# EAGLE design Fubarino_SDZ_v10 (EAGLE 6.5.0)
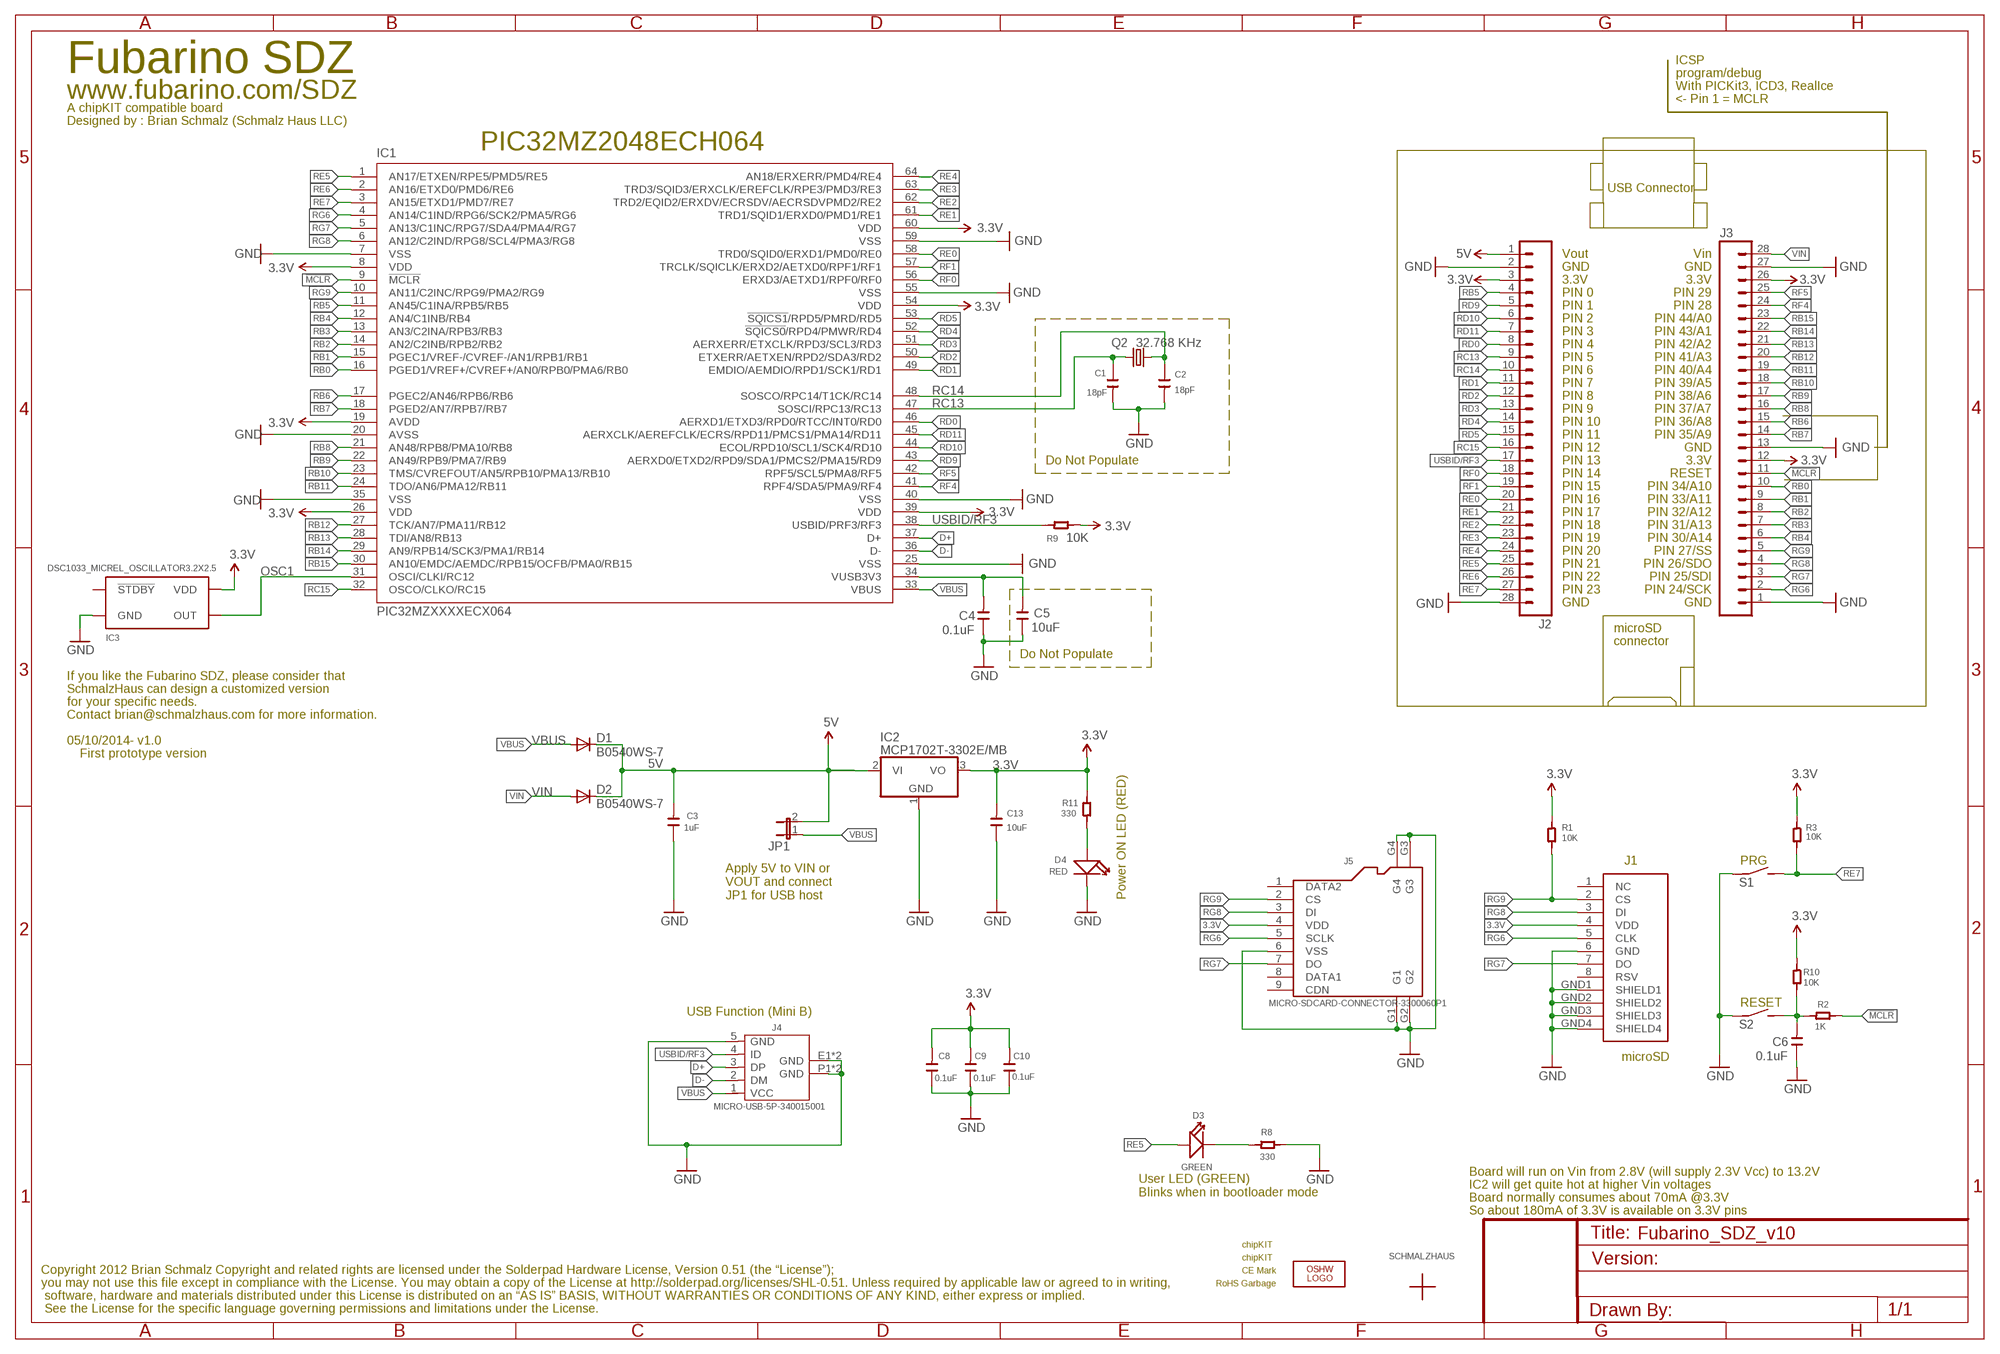
[diagram p0: schematic, sheet 1]

## Parts
C1  18pF  C-0603  [C0603]
C2  18pF  C-0603  [C0603]
C3  1uF  C-0603  [C0603]
C4  0.1uF  C-0603  [C0603]
C5  10uF  C-0805  [C0805]
C6  0.1uF  C-0603  [C0603]
C8  0.1uF  C-0603  [C0603]
C9  0.1uF  C-0603  [C0603]
C10  0.1uF  C-0603  [C0603]
C13  10uF  C-0805  [C0805]
D1  B0540WS-7  DIODESOD  [SOD-323]
D2  B0540WS-7  DIODESOD  [SOD-323]
D3  GREEN  LED  [LED0603]
D4  RED  LED  [LED0603]
IC1  PIC32MZXXXXECX064  [TQFP64-10X10]
IC2  MCP1702T-3302E/MB  MCP170333MB  [SOT89]
IC3  DSC1033_MICREL_OSCILLATOR3.2X2.5  [3.2X2.5_SILABS_OSC_DSC1033]
J1  MICRO_SD_CARD_SOCKET  [SD-MMC_SOCKET-PP]
J2  M28USEPIN1  [1X28]
J3  M28NOPIN1  [1X28_NO_PIN_1]
J4  MICRO-USB-5P-340015001  [B-SMD-5P]
J5  MICRO-SDCARD-CONNECTOR-3300060P1  [9P-SMD-W-RING]
JP1  JUMPER-2SMD-NO  [SJ_2S-NO]
LOGO1  OSHW_LOGO_8MILX0070-NT  [OSHW_8X70_NOTEXT]
Q2  32.768 KHz  CRYSTALTC26H  [TC26H]
R1  10K  R-0603  [R0603]
R2  1K  R-0603  [R0603]
R3  10K  R-0603  [R0603]
R8  330  R-0603  [R0603]
R9  10K  R-0603  [R0603]
R10  10K  R-0603  [R0603]
R11  330  R-0603  [R0603]
S1  SWITCH  [SWITCH_KMR_SMT_TACT]
S2  SWITCH  [SWITCH_KMR_SMT_TACT]
U$1  SCHMALZHAUSSCHMALZHAUS_SMALL  [SCHMALZHAUS_SMALL]
U$2  CE_MARK5MM  [CE_5MM]
U$3  ROHS_GARBAGE  [ROHS_GARBAGE_5MM]
U$4  CHIPKIT2MM  [CHIPKIT_2MM]
U$5  CHIPKIT2MM  [CHIPKIT_2MM]

## Nets
3.3V: C8.1 C9.1 C10.1 C13.1 IC1.8(VDD) IC1.19(AVDD) IC1.26(VDD) IC1.39(VDD) IC1.54(VDD) IC1.60(VDD) IC2.3(VO) IC3.P$4(VDD) J1.4(VDD) J2.3 J3.12 J3.26 J5.4(VDD) R1.1 R3.1 R9.2 R10.1 R11.2
5V: C3.1 D1.1(C) D2.1(C) IC2.2(VI) IC2.2@1(VI1) J2.1 JP1.2
!MCLR!: IC1.9(!MCLR!) J3.11 R2.2
$MCLR: C6.1 R2.1 R10.2 S2.P$3 S2.P$4
D+: IC1.37(D+) J4.3(DP)
D-: IC1.36(D-) J4.2(DM)
GND: C1.1 C2.1 C3.2 C4.2 C5.2 C6.2 C8.2 C9.2 C10.2 C13.2 D4.- IC1.7(VSS) IC1.20(AVSS) IC1.25(VSS) IC1.35(VSS) IC1.40(VSS) IC1.55(VSS) IC1.59(VSS) IC2.1(GND) IC3.P$2(GND) J1.6(GND) J1.GND1(SHIELD1) J1.GND2(SHIELD2) J1.GND3(SHIELD3) J1.GND4(SHIELD4) J2.2 J2.28 J3.1 J3.13 J3.27 J4.5(GND) J4.E1(GND) J4.E2(GND) J4.P1(GND) J4.P2(GND) J5.6(VSS) J5.G1 J5.G2 J5.G3 J5.G4 R8.2 S1.P$1 S1.P$2 S2.P$1 S2.P$2
N$6: D4.+ R11.1
N$20: D3.- R8.1
N$110: C4.1 C5.1 IC1.34(VUSB3V3)
OSC1: IC1.31(OSCI/CLKI/RC12) IC3.P$3(OUT)
RB0: IC1.16(PGED1/VREF+/CVREF+/AN0/RPB0/PMA6/RB0) J3.10
RB1: IC1.15(PGEC1/VREF-/CVREF-/AN1/RPB1/RB1) J3.9
RB2: IC1.14(AN2/C2INB/RPB2/RB2) J3.8
RB3: IC1.13(AN3/C2INA/RPB3/RB3) J3.7
RB4: IC1.12(AN4/C1INB/RB4) J3.6
RB5: IC1.11(AN45/C1INA/RPB5/RB5) J2.4
RB6: IC1.17(PGEC2/AN46/RPB6/RB6) J3.15
RB7: IC1.18(PGED2/AN7/RPB7/RB7) J3.14
RB8: IC1.21(AN48/RPB8/PMA10/RB8) J3.16
RB9: IC1.22(AN49/RPB9/PMA7/RB9) J3.17
RB10: IC1.23(TMS/CVREFOUT/AN5/RPB10/PMA13/RB10) J3.18
RB11: IC1.24(TDO/AN6/PMA12/RB11) J3.19
RB12: IC1.27(TCK/AN7/PMA11/RB12) J3.20
RB13: IC1.28(TDI/AN8/RB13) J3.21
RB14: IC1.29(AN9/RPB14/SCK3/PMA1/RB14) J3.22
RB15: IC1.30(AN10/EMDC/AEMDC/RPB15/OCFB/PMA0/RB15) J3.23
RC13: C1.2 IC1.47(SOSCI/RPC13/RC13) J2.9 Q2.1
RC14: C2.2 IC1.48(SOSCO/RPC14/T1CK/RC14) J2.10 Q2.2
RC15: IC1.32(OSCO/CLKO/RC15) J2.16
RD0: IC1.46(AERXD1/ETXD3/RPD0/RTCC/INT0/RD0) J2.8
RD1: IC1.49(EMDIO/AEMDIO/RPD1/SCK1/RD1) J2.11
RD2: IC1.50(ETXERR/AETXEN/RPD2/SDA3/RD2) J2.12
RD3: IC1.51(AERXERR/ETXCLK/RPD3/SCL3/RD3) J2.13
RD4: IC1.52(!SQICS0!/RPD4/PMWR/RD4) J2.14
RD5: IC1.53(!SQICS1!/RPD5/PMRD/RD5) J2.15
RD9: IC1.43(AERXD0/ETXD2/RPD9/SDA1/PMCS2/PMA15/RD9) J2.5
RD10: IC1.44(ECOL/RPD10/SCL1/SCK4/RD10) J2.6
RD11: IC1.45(AERXCLK/AEREFCLK/ECRS/RPD11/PMCS1/PMA14/RD11) J2.7
RE0: IC1.58(TRD0/SQID0/ERXD1/PMD0/RE0) J2.20
RE1: IC1.61(TRD1/SQID1/ERXD0/PMD1/RE1) J2.21
RE2: IC1.62(TRD2/EQID2/ERXDV/ECRSDV/AECRSDVPMD2/RE2) J2.22
RE3: IC1.63(TRD3/SQID3/ERXCLK/EREFCLK/RPE3/PMD3/RE3) J2.23
RE4: IC1.64(AN18/ERXERR/PMD4/RE4) J2.24
RE5: D3.+ IC1.1(AN17/ETXEN/RPE5/PMD5/RE5) J2.25
RE6: IC1.2(AN16/ETXD0/PMD6/RE6) J2.26
RE7: IC1.3(AN15/ETXD1/PMD7/RE7) J2.27 R3.2 S1.P$3 S1.P$4
RF0: IC1.56(ERXD3/AETXD1/RPF0/RF0) J2.18
RF1: IC1.57(TRCLK/SQICLK/ERXD2/AETXD0/RPF1/RF1) J2.19
RF4: IC1.41(RPF4/SDA5/PMA9/RF4) J3.24
RF5: IC1.42(RPF5/SCL5/PMA8/RF5) J3.25
RG6: IC1.4(AN14/C1IND/RPG6/SCK2/PMA5/RG6) J1.5(CLK) J3.2 J5.5(SCLK)
RG7: IC1.5(AN13/C1INC/RPG7/SDA4/PMA4/RG7) J1.7(DO) J3.3 J5.7(DO)
RG8: IC1.6(AN12/C2IND/RPG8/SCL4/PMA3/RG8) J1.3(DI) J3.4 J5.3(DI)
RG9: IC1.10(AN11/C2INC/RPG9/PMA2/RG9) J1.2(CS) J3.5 J5.2(CS) R1.2
USBID/RF3: IC1.38(USBID/PRF3/RF3) J2.17 J4.4(ID) R9.1
VBUS: D1.2(A) IC1.33(VBUS) J4.1(VCC) JP1.1
VIN: D2.2(A) J3.28
Unconnected: IC3.P$1(!STDBY!) J1.1(NC) J1.8(RSV) J5.1(DATA2) J5.8(DATA1) J5.9(CDN)

## Notes on the sheet
- ICSP
- Fubarino SDZ
- program/debug
- With PICKit3, ICD3, RealIce
- www.fubarino.com/SDZ
- <- Pin 1 = MCLR
- A chipKIT compatible board
- Designed by : Brian Schmalz (Schmalz Haus LLC)
- PIC32MZ2048ECH064
- USB Connector
- Vin
- Vout
- GND
- GND
- 3.3V
- 3.3V
- PIN 29
- PIN 0
- PIN 28
- PIN 1
- PIN 44/A0
- PIN 2
- PIN 43/A1
- PIN 3
- PIN 42/A2
- PIN 4
- PIN 41/A3
- PIN 5
- PIN 40/A4
- PIN 6
- PIN 39/A5
- PIN 7
- PIN 38/A6
- PIN 8
- PIN 37/A7
- PIN 9
- PIN 36/A8
- PIN 10
- PIN 35/A9
- PIN 11
- GND
- PIN 12
- 3.3V
- Do Not Populate | PIN 13
- RESET
- PIN 14
- PIN 34/A10
- PIN 15
- PIN 33/A11
- PIN 16
- PIN 32/A12
- PIN 17
- PIN 31/A13
- PIN 18
- PIN 30/A14
- PIN 19
- PIN 27/SS
- PIN 20
- PIN 26/SDO
- PIN 21
- PIN 25/SDI
- PIN 22
- PIN 24/SCK
- PIN 23
- GND
- GND
- microSD
- connector
- Do Not Populate
- If you like the Fubarino SDZ, please consider that
- SchmalzHaus can design a customized version
- for your specific needs.
- Contact brian@schmalzhaus.com for more information.
- 05/10/2014- v1.0
- First prototype version
- J1 | PRG
- Apply 5V to VIN or 
  VOUT and connect 
  JP1 for USB host
- Power ON LED (RED)
- RESET
- USB Function (Mini B)
- microSD
- Board will run on Vin from 2.8V (will supply 2.3V Vcc) to 13.2V
- IC2 will get quite hot at higher Vin voltages
- User LED (GREEN)
  Blinks when in bootloader mode
- Board normally consumes about 70mA @3.3V
- So about 180mA of 3.3V is available on 3.3V pins
- Copyright 2012 Brian Schmalz Copyright and related rights are licensed under the Solderpad Hardware License, Version 0.51 (the “License”);
- you may not use this file except in compliance with the License. You may obtain a copy of the License at http://solderpad.org/licenses/SHL-0.51. Unless required by applicable law or agreed to in writing,
- software, hardware and materials distributed under this License is distributed on an “AS IS” BASIS, WITHOUT WARRANTIES OR CONDITIONS OF ANY KIND, either express or implied.
- See the License for the specific language governing permissions and limitations under the License.

## Library data of the parts
C1-C6 C8-C10 C13 = OPL Eagle Library:C*
D1 D2 = SparkFun:DIODE: Diode These are standard reverse protection diodes and small signal diodes. SMA package can handle up to about 1A. SOD-323 can handle about 200mA. What the SOD-323 package when ordering, there are some mfgs out there that are 5-pin packages.
D3 D4 = OPL Eagle Library:LED*: LED
IC1 = SchmalzHaus:PIC32MZXXXXECX064: PIC32MZxxxxECx064 TQFP 10mm x 10mm http://ww1.microchip.com/downloads/en/DeviceDoc/60001191B.pdf
IC2 = linear:MCP1703*: 250 mA, 16V, Low Quiescent Current LDO Regulator Source: http://ww1.microchip.com/downloads/en/DeviceDoc/22049b.pdf
IC3 = SchmalzHaus:DSC1033_MICREL_OSCILLATOR: http://www.micrel.com/_PDF/clk/DSC1033.pdf Micrel oscillator - DSC1033 family
J1 = SchmalzHaus:MICRO_SD_CARD_SOCKET: SD/MMC Socket Media socket for SD and MMC cards. Push-push type. Schematic element and footprint production proven. Spark Fun Electronics SKU : PRT-00136
J2 J3 = SchmalzHaus:M28
J4 = OPL Eagle Library:MICRO-USB-5P: ST-USB-001E：MICRO USB B SMD R/A
J5 = OPL Eagle Library:MICRO-SDCARD-CONNECTOR: Micro SD Card
JP1 = SparkFun-Passives:JUMPER-2: Jumper Basic 0.1" spaced jumper. Use with breakaway headers.
LOGO1 = OSHW:OSHW_LOGO_8MIL
Q2 = SchmalzHaus:CRYSTAL: Crystals Various standard crystals. Proven footprints. Spark Fun Electronics SKU : COM-00534
R1-R3 R8-R11 = OPL Eagle Library:R*
S1 S2 = SchmalzHaus:SWITCH: DIL/CODE SWITCH
U$1 = SchmalzHaus:SCHMALZHAUS
U$2 = SchmalzHausPublic:CE_MARK
U$3 = SchmalzHausPublic:ROHS_GARBAGE
U$4 U$5 = SchmalzHausPublic:CHIPKIT

## Board
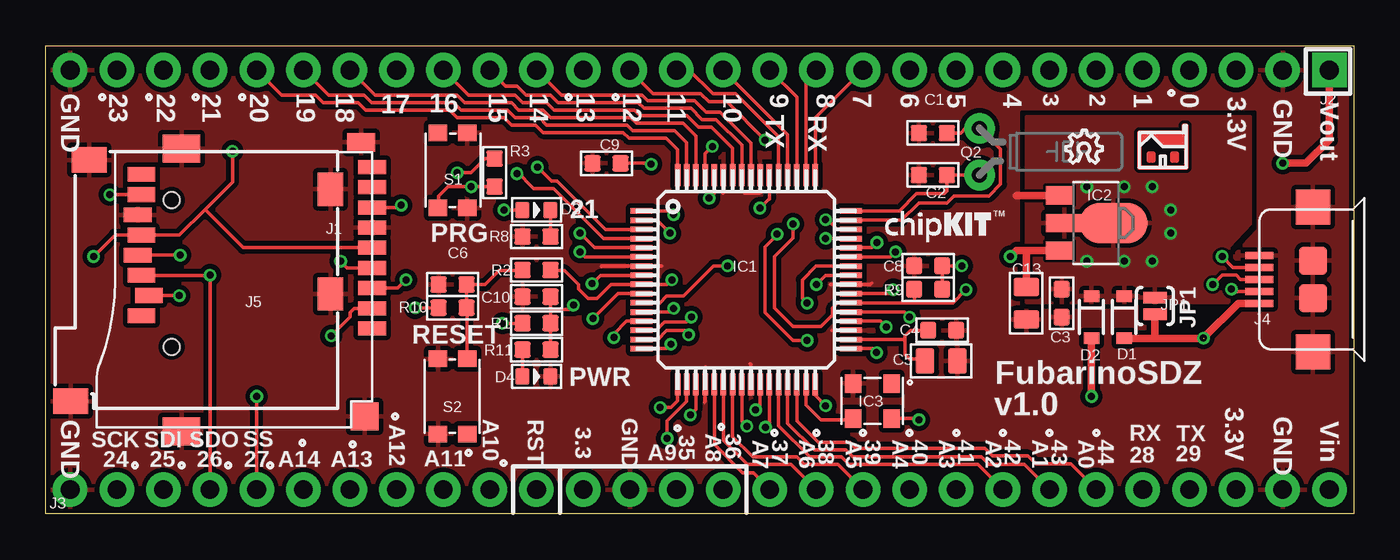
[diagram p1: board, top side]
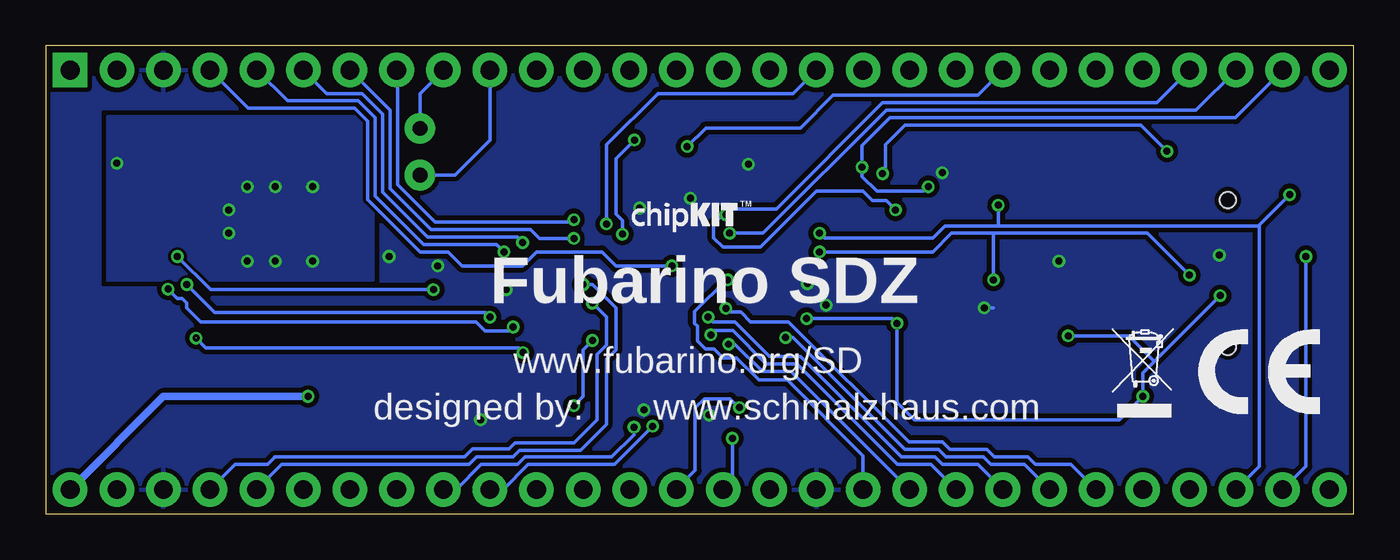
[diagram p2: board, bottom side, seen from below]

Size 71.22 x 25.5 mm. Coordinates in mm from the lower left corner, seen from the top.
Outline: 0,25.5 71.22,25.5 71.22,0 0,0 0,25.5
Copper layers (1*16): Top 0.035mm / dielectric 0.2mm / Bottom 0.035mm
Design rules "SeeedStudio_DRU_20130527 *": minimum track width 6mil, minimum drill 12mil, track to track 6mil, track to pad 6mil, pad to pad 6mil, via to via 6mil, smd to smd 0mil, copper to edge 10mil, drill to drill 10mil, minimum pad ring 6mil, minimum via ring 6mil, stop-mask expansion 2mil, vias tented up to drill 25mil, thermal gap 10mil

### Footprints (pad centres in the part's own frame; a part is rotated, then mirrored left to right if it is on the bottom)
C0603 = smd 0.889 x 0.889: 1 -0.762,0; 2 0.762,0
C0805 = smd 1.016 x 1.397: 1 -0.889,0; 2 0.889,0
SOD-323 = smd 0.63 x 0.83: 1 -1.15,0; 2 1.15,0
LED0603 = smd 0.762 x 0.889: + -0.762,0; - 0.762,0
TQFP64-10X10 = smd 1.2 x 0.3: 1 -5.7,3.75; 2 -5.7,3.25; 3 -5.7,2.75; 4 -5.7,2.25; 5 -5.7,1.75; 6 -5.7,1.25; 7 -5.7,0.75; 8 -5.7,0.25; 9 -5.7,-0.25; 10 -5.7,-0.75; 11 -5.7,-1.25; 12 -5.7,-1.75; 13 -5.7,-2.25; 14 -5.7,-2.75; 15 -5.7,-3.25; 16 -5.7,-3.75; 33 5.7,-3.75; 34 5.7,-3.25; 35 5.7,-2.75; 36 5.7,-2.25; 37 5.7,-1.75; 38 5.7,-1.25; 39 5.7,-0.75; 40 5.7,-0.25; 41 5.7,0.25; 42 5.7,0.75; 43 5.7,1.25; 44 5.7,1.75; 45 5.7,2.25; 46 5.7,2.75; 47 5.7,3.25; 48 5.7,3.75 | smd 0.3 x 1.2: 17 -3.75,-5.7; 18 -3.25,-5.7; 19 -2.75,-5.7; 20 -2.25,-5.7; 21 -1.75,-5.7; 22 -1.25,-5.7; 23 -0.75,-5.7; 24 -0.25,-5.7; 25 0.25,-5.7; 26 0.75,-5.7; 27 1.25,-5.7; 28 1.75,-5.7; 29 2.25,-5.7; 30 2.75,-5.7; 31 3.25,-5.7; 32 3.75,-5.7; 49 3.75,5.7; 50 3.25,5.7; 51 2.75,5.7; 52 2.25,5.7; 53 1.75,5.7; 54 1.25,5.7; 55 0.75,5.7; 56 0.25,5.7; 57 -0.25,5.7; 58 -0.75,5.7; 59 -1.25,5.7; 60 -1.75,5.7; 61 -2.25,5.7; 62 -2.75,5.7; 63 -3.25,5.7; 64 -3.75,5.7
SOT89 = smd 1 x 1.5: 1 -1.499,-1.981; 3 1.499,-1.981 | smd 1 x 2: 2 0,-1.727 | smd 2.2 x 3.7: 2@1 0,0.94
3.2X2.5_SILABS_OSC_DSC1033 = smd 0.9 x 1: P$1 -1.05,-0.95; P$2 1.05,-0.95; P$3 1.05,0.95; P$4 -1.05,0.95
SD-MMC_SOCKET-PP = smd 0.8 x 1.5: 1 -8.94,10.7; 2 -7.84,10.3; 3 -6.74,10.7; 4 -5.64,10.9; 5 -4.54,10.7; 6 -3.44,10.9; 7 -2.34,10.7; 8 -1.24,10.7 | smd 1.4 x 1.9: GND1 -13.6,14.55; GND2 -0.45,13.55 | smd 1.8 x 1.4: GND3 -7.75,0.4; GND4 -2.05,0.4
1X28 = drill 1.016 pad 1.88 square: 1 0,0 | drill 1.016 pad 1.88: 2 2.54,0; 3 5.08,0; 4 7.62,0; 5 10.16,0; 6 12.7,0; 7 15.24,0; 8 17.78,0; 9 20.32,0; 10 22.86,0; 11 25.4,0; 12 27.94,0; 13 30.48,0; 14 33.02,0; 15 35.56,0; 16 38.1,0; 17 40.64,0; 18 43.18,0; 19 45.72,0; 20 48.26,0; 21 50.8,0; 22 53.34,0; 23 55.88,0; 24 58.42,0; 25 60.96,0; 26 63.5,0; 27 66.04,0; 28 68.58,0
1X28_NO_PIN_1 = drill 1.016 pad 1.88: 1 0,0; 2 2.54,0; 3 5.08,0; 4 7.62,0; 5 10.16,0; 6 12.7,0; 7 15.24,0; 8 17.78,0; 9 20.32,0; 10 22.86,0; 11 25.4,0; 12 27.94,0; 13 30.48,0; 14 33.02,0; 15 35.56,0; 16 38.1,0; 17 40.64,0; 18 43.18,0; 19 45.72,0; 20 48.26,0; 21 50.8,0; 22 53.34,0; 23 55.88,0; 24 58.42,0; 25 60.96,0; 26 63.5,0; 27 66.04,0; 28 68.58,0
B-SMD-5P = smd 0.38 x 1.52: 1 -1.3,2.54; 2 -0.65,2.54; 3 0,2.54; 4 0.65,2.54; 5 1.3,2.54 | smd 1.524 x 1.524: E1 -1.016,-0.381; E2 1.016,-0.381 | smd 1.9 x 1.9: P1 -3.95,-0.381; P2 3.95,-0.381
9P-SMD-W-RING = smd 1.524 x 0.762: 1 -7.493,2.114; 2 -7.493,1.014; 3 -7.493,-0.086; 4 -7.493,-1.186; 5 -7.493,-2.286; 6 -7.493,-3.386; 7 -7.493,-4.486; 8 -7.493,-5.586; 9 -7.493,-6.686 | smd 1.524 x 1.016: G1 -6.893,-8.032 | smd 2.032 x 1.524: G2 2.88,-7.686; G3 2.88,7.714 | smd 1.524 x 1.524: G4 -7.101,6.895 | hole 0.889: 3.407,-4.886; 3.407,3.114
SJ_2S-NO = smd 0.635 x 1.27: 1 -0.45,0; 2 0.45,0
TC26H = drill 0.813 pad 1.676: 1 -1.27,0; 2 1.27,0
R0603 = smd 0.889 x 0.889: 1 -0.762,0; 2 0.762,0
SWITCH_KMR_SMT_TACT = smd 0.9 x 1: P$1 -2.05,-0.8; P$2 2.05,-0.8; P$3 2.05,0.8; P$4 -2.05,0.8

### Placement (x,y rotation side)
C1  48.31,20.75 0 top
C2  48.31,18.47 0 top
C3  55.32,11.48 270 top
C4  48.82,10.01 0 top
C5  48.77,8.33 0 top
C6  22.15,12.5 180 top
C8  48.06,13.51 180 top
C9  30.53,19.1 180 top
C10  26.72,11.84 180 top
C13  53.39,11.48 270 top
D1  58.72,10.72 270 top
D2  56.95,10.72 270 top
D3  26.72,16.56 0 top
D4  26.72,7.49 0 top
DRILEGEND  [DRILEGEND]  101.41,40.18 0 top  (outside the outline)
IC1  38.15,12.75 0 top
IC2  57.2,15.85 270 top
IC3  45.01,6.15 180 top
J1  15.9,19.74 90 top
J2  69.9,24.18 180 top
J3  1.32,1.32 0 top
J4  68.63,12.78 90 top
J5  10.26,12.22 180 top
JP1  60.4,11.33 90 top
LOGO1  55.55,19.13 0 top
Q2  50.85,19.74 270 top
R1  26.72,10.39 180 top
R2  26.72,13.28 0 top
R3  24.43,18.59 270 top
R8  26.72,15.11 180 top
R9  48.06,12.24 0 top
R10  22.15,11.23 0 top
R11  26.72,8.94 0 top
S1  22.15,18.72 90 top
S2  22.15,6.4 270 top
U$1  60.83,18.87 0 top
U$2  5.13,7.8 0 bottom
U$3  13.13,5.26 0 bottom
U$4  45.59,14.76 0 top
U$5  39.42,15.29 0 bottom

### Tracks (layer width: path | path; a pad name or v marks a point on that pad's centre or on a via)
3.3V  (via drill 0.38)
  Top 0.203: J1.4 v7.31,14.1 | C9.1 32.92,19.1 v32.97,19.05 | 38.91,7.05 IC1.26 38.9,5.91 v38.66,5.66 | IC1.54 39.4,17.16 39.39,17.16 v38.89,16.66 | IC1.60 36.4,17.48 v36.12,17.2 | IC1.19 35.4,5.68 v35.1,5.38 | IC1.8 30.2,13 v29.74,12.55 | R9.2 C8.1 v49.89,13.51 | IC1.39 45.93,12 v46.15,12.22 | IC3.P$4 47.48,5.2 v47.55,5.13 | C10.1 27.48,11.15 | 27.48,11.15 R1.1 R11.2 | 27.48,11.15 28.5,11.15 v28.73,11.38 | R10.1 v20.12,11.23 | J5.4 16.42,13.4 v16.05,13.77 | R3.1 23.93,19.35 23.16,18.59 v22.4,18.59
  Top 0.406: IC2.3 53.39,14.35 | 53.39,14.35 52.86,14.35 v52.53,14.02 | C13.1 53.39,14.35
  Bottom 0.203: v46.15,12.22 46.15,12.27 | v20.12,11.23 19.61,11.23
  pour Bottom (isolate 0.254, rank 3): 0.05,0.05 0.05,25.45 71.17,25.45 71.17,0.05
5V  (via drill 0.38)
  Top 0.406: v67.36,19.1 68.63,19.1 69.9,20.37 J2.1
  other vias: 60.25,17.83 56.69,17.83 56.69,13.77 58.72,13.77 58.72,17.83 60.25,13.77 61.26,16.56 61.26,15.29
  pour Top: 65.58,21.64 53.39,21.64 53.39,11.53 64.41,11.53 64.41,14.53 65.58,15.8
  pour Bottom: 53.39,21.64 53.39,12.75 67.87,12.75 67.87,21.64
!MCLR!  (via drill 0.38)
  Top 0.203: R2.2 27.51,13.26 28.24,13.26 29.01,12.5 29.01,12.24 29.51,11.73 30.02,11.73 30.79,12.5 IC1.9 33.84,12.5 v34.09,12.75
  Bottom 0.203: J3.11 26.72,3.17 30.84,7.29 32.38,7.29 33.6,8.51 34.34,8.51 34.82,8.99 35.31,8.99 35.74,9.42 35.74,10.24 35.89,10.39 35.89,11.02 34.16,12.75 v34.09,12.75
$MCLR
  Top 0.203: R2.1 25.93,13.26 24.69,13.26 23.93,12.5 C6.1 R10.2 22.95,11.19 S2.P$4
D+  (via drill 0.38)
  Top 0.203: J4.3 65.05,12.78 64.82,13 64.06,13 v63.55,12.5 | IC1.37 46.76,11 v47.04,10.72
  Bottom 0.203: v63.55,12.5 62.03,10.97 47.29,10.97 v47.04,10.72
D-  (via drill 0.38)
  Top 0.203: J4.2 64.68,12.13 v64.57,12.24 | IC1.36 45.46,10.5 v45.77,10.19
  Bottom 0.203: v64.57,12.24 64.06,11.73 63.8,11.73 63.55,11.48 63.55,11.23 62.79,10.46 47.8,10.46 47.29,9.96 46,9.96 v45.77,10.19
GND
  Top 0.203: IC1.59 36.9,17.49 36.88,17.47 | 42.72,12.5 42.73,12.5 IC1.40 44.91,12.5 44.98,12.57 | 35.92,8 35.9,7.99 IC1.20 35.9,6.11 35.86,6.07 | IC1.25 38.4,8.13 38.35,8.18 | 33.55,13.51 33.54,13.5 IC1.7 30.26,13.5 30.25,13.49 | IC1.35 42.81,10 42.8,10.01 | IC1.55 38.9,17.49 38.89,17.47 38.05,17.47
  Top 0.406: 52.86,17.35 IC2.1
  pour Top (isolate 0.254, rank 4): 0.05,25.45 0.05,0.05 71.17,0.05 71.17,25.45
N$6
  Top 0.203: R11.1 D4.+
N$20
  Top 0.203: D3.- R8.1
N$110
  Top 0.203: IC1.34 46.73,9.5 46.79,9.45 | C4.1 47.09,10.01 46.79,9.7 46.79,9.45 | 46.79,9.45 46.79,8.69 47.04,8.43 47.78,8.43 C5.1
OSC1
  Top 0.203: IC1.31 41.4,5.94 42.21,5.13 43.89,5.13 IC3.P$3
RB0  (via drill 0.38)
  Top 0.203: v34.04,9.25 33.79,9 IC1.16
  Bottom 0.203: J3.10 30.63,7.77 32.21,7.77 33.68,9.25 v34.04,9.25
RB1  (via drill 0.38)
  Top 0.203: v35,9.75 34.77,9.98 33.81,9.98 33.33,9.5 IC1.15
  Bottom 0.203: v35,9.75 34.77,9.98 33.81,9.98 32,8.18 30.33,8.18 24.84,2.69 23.01,2.69 J3.9
RB2  (via drill 0.38)
  Top 0.203: v35.15,10.72 34.9,10.46 33.68,10.46 33.22,10 IC1.14
  Bottom 0.203: v35.15,10.72 34.9,10.46 33.68,10.46 31.8,8.58 30.12,8.58 24.64,3.1 22.81,3.1 22.4,2.69 20.47,2.69 J3.8
RB3  (via drill 0.38)
  Top 0.203: v30.94,9.6 30.94,9.8 31.63,10.5 IC1.13
  Bottom 0.203: J3.7 17.93,2.69 19.76,2.69 20.17,3.1 22.2,3.1 22.61,3.5 24.43,3.5 30.53,9.6 v30.94,9.6
RB4  (via drill 0.38)
  Top 0.203: v34.19,11.2 33.99,11 | 33.99,11 33.98,11 | IC1.12 33.99,11
  Bottom 0.203: v34.19,11.2 33.98,11 33.38,11 32.84,10.46 30.78,10.46 24.23,3.91 22.4,3.91 22,3.5 19.96,3.5 19.56,3.1 17.73,3.1 17.32,2.69 15.39,2.69 J3.6
RB5  (via drill 0.38)
  Top 0.203: v37.13,13.51 36.37,13.51 34.72,11.86 33.81,11.86 33.45,11.5 IC1.11
  Bottom 0.203: J2.4 60.2,22.1 54.41,22.1 53.7,21.39 53.7,17.12 50.85,14.27 49.33,14.27 48.56,13.51 45.26,13.51 44.5,14.27 40.94,14.27 40.18,13.51 v37.13,13.51
RB6  (via drill 0.38)
  Top 0.203: IC1.17 34.4,6.16 34.04,5.79 v33.45,5.79
  Bottom 0.203: J3.15 36.88,1.35 35.86,2.36 35.86,5.77 35.36,6.27 33.96,6.27 33.48,5.79 v33.45,5.79
RB7  (via drill 0.38)
  Top 0.203: v33.83,4.11 33.83,5.05 34.9,6.12 IC1.18
  Bottom 0.203: J3.14 33.83,1.83 v33.83,4.11
RB8
  Top 0.203: IC1.21 36.4,3.78 37.95,2.23 38.53,2.23 39.42,1.35 J3.16
RB9
  Top 0.203: J3.17 40.59,2.69 38.2,2.69 36.9,3.99 IC1.22
RB10
  Top 0.203: IC1.23 37.4,4.2 38.51,3.1 40.89,3.1 41.3,2.69 43.13,2.69 J3.18
RB11  (via drill 0.38)
  Top 0.203: IC1.24 37.9,5.05 v38.18,4.77
  Bottom 0.203: J3.19 46.33,1.32 44.96,2.69 40.26,2.69 v38.18,4.77
RB12  (via drill 0.38)
  Top 0.203: IC1.27 39.4,4.92 39.39,4.92 v39.19,4.72
  Bottom 0.203: J3.20 48.89,1.32 47.52,2.69 45.54,2.69 45.14,3.1 40.41,3.1 39.19,4.32 v39.19,4.72
RB13
  Top 0.203: J3.21 50.75,2.69 43.74,2.69 43.33,3.1 41.6,3.1 39.9,4.8 IC1.28
RB14
  Top 0.203: J3.22 53.29,2.69 51.36,2.69 50.95,3.1 43.97,3.1 43.59,3.48 41.86,3.48 40.4,4.94 IC1.29
RB15
  Top 0.203: J3.23 57.2,1.35 55.83,2.72 53.92,2.72 53.49,3.15 51.56,3.15 51.13,3.58 44.09,3.58 43.79,3.89 42.09,3.89 40.9,5.07 IC1.30
RC13
  Top 0.203: C1.2 49.83,20.75 50.09,21.01 Q2.1 51.99,19.86 51.99,17.96 51.36,17.32 49.45,17.32 49.07,16.94 47.55,16.94 46.61,16 IC1.47
  Bottom 0.203: Q2.1 50.85,22.91 J2.9
RC14
  Top 0.203: IC1.48 46.47,16.5 47.42,17.45 48.95,17.45 49.07,17.58 C2.2 Q2.2
  Bottom 0.203: J2.10 47.04,20.37 48.95,18.47 Q2.2
RC15  (via drill 0.38)
  Top 0.203: J2.16 33.07,22.91 35.66,22.91 36.12,22.45 37.08,22.45 v39.17,20.37 | v39.83,15.24 39.83,15.19 39.17,14.53 39.17,10.97 40.69,9.45 v41.45,9.45 | IC1.32 41.9,6.46 v42.47,5.89
  Bottom 0.203: v39.17,20.37 40.18,19.35 40.18,16.33 39.83,15.98 v39.83,15.24 | v41.45,9.45 41.96,8.94 41.96,6.4 v42.47,5.89
RD0  (via drill 0.38)
  Top 0.203: IC1.46 43.1,15.5 42.57,16.03 v42.47,16.03
  Bottom 0.203: J2.8 52.07,24.13 52.07,17.93 50.04,15.9 42.6,15.9 v42.47,16.03
RD1
  Top 0.203: J2.11 41.9,21.58 IC1.49
RD2
  Top 0.203: J2.12 41.4,23.62 IC1.50
RD3
  Top 0.203: J2.13 40.9,22.7 IC1.51
RD4
  Top 0.203: J2.14 40.4,20.66 IC1.52
RD5
  Top 0.203: J2.15 35.03,24.18 36.32,22.89 37.57,22.89 39.9,20.55 IC1.53
RD9  (via drill 0.38)
  Top 0.203: IC1.43 46,14 v46.28,14.27
  Bottom 0.203: J2.5 58.06,22.5 54.2,22.5 53.29,21.59 53.29,17.32 50.65,14.68 46.68,14.68 v46.28,14.27
RD10  (via drill 0.38)
  Top 0.203: IC1.44 44.98,14.5 v45.26,14.78
  Bottom 0.203: 57.15,24.13 J2.6 55.93,22.91 54,22.91 52.88,21.79 52.88,17.53 50.44,15.09 45.54,15.09 45.24,14.78 v45.26,14.78
RD11  (via drill 0.38)
  Top 0.203: IC1.45 v42.48,15 v42.47,15.01
  Bottom 0.203: J2.7 52.48,22 52.48,17.73 50.24,15.49 44.83,15.49 44.33,15 v42.48,15 v42.47,15.01
RE0
  Top 0.203: J2.20 23.01,22.81 25.55,22.81 25.96,22.4 27.28,22.4 27.69,22 32.05,22 32.36,21.69 34.92,21.69 35.53,21.08 36.25,21.08 37.4,19.93 IC1.58
RE1  (via drill 0.38)
  Top 0.203: IC1.61 35.9,19.62 v36.3,20.01
  Bottom 0.203: J2.21 20.47,22.81 28.35,22.81 30.12,21.03 35.28,21.03 v36.3,20.01
RE2
  Top 0.203: J2.22 17.93,22.81 22.4,22.81 22.81,22.4 25.35,22.4 25.76,22 27.08,22 27.48,21.59 31.85,21.59 32.16,21.28 34.7,21.28 35.4,20.58 IC1.62
RE3
  Top 0.203: J2.23 15.39,22.81 17.32,22.81 17.73,22.4 22.2,22.4 22.61,22 25.15,22 25.55,21.59 26.87,21.59 27.28,21.18 31.65,21.18 31.95,20.88 34.24,20.88 34.9,20.22 IC1.63
RE4
  Top 0.203: J2.24 12.85,22.81 14.68,22.81 15.09,22.4 17.02,22.4 17.42,22 22,22 22.4,21.59 24.94,21.59 25.35,21.18 26.67,21.18 27.08,20.78 31.44,20.78 31.75,20.47 33.78,20.47 34.4,19.85 IC1.64
RE5  (via drill 0.38)
  Top 0.203: v34.19,16.31 34.09,16.31 33.89,16.5 IC1.1 | v24.94,16.56 D3.+
  Bottom 0.203: J2.25 10.72,22.4 25.65,22.4 31.44,16.61 33.88,16.61 v34.19,16.31 34.34,16.31 34.85,15.8 34.85,15.04 34.34,14.53 32.31,14.53 30.28,16.56 29.26,17.58 26.72,17.58 26.21,17.07 25.45,17.07 v24.94,16.56
RE6  (via drill 0.38)
  Top 0.203: v33.98,15.29 33.27,16 IC1.2
  Bottom 0.203: v33.98,15.29 32.16,15.29 25.45,22 8.58,22 J2.26
RE7  (via drill 0.38)
  Top 0.203: v26.77,18.9 27.53,18.14 27.84,18.14 30.47,15.5 IC1.3 | R3.2 v23.16,17.83 21.89,17.83 21.39,17.32 21.39,16.71 S1.P$4
  Bottom 0.203: J2.27 6.45,21.59 25.25,21.59 26.77,20.07 v26.77,18.9 26.77,18.64 26.77,18.39 25.96,17.58 23.42,17.58 v23.16,17.83
RF0
  Top 0.203: J2.18 28.09,22.81 32.46,22.81 32.77,22.5 35.33,22.5 35.94,21.89 36.7,21.89 38.4,20.2 IC1.56
RF1
  Top 0.203: J2.19 25.04,23.32 25.65,23.32 26.16,22.81 27.48,22.81 27.89,22.4 32.26,22.4 32.56,22.1 35.13,22.1 35.74,21.49 36.5,21.49 37.9,20.09 IC1.57
RF4  (via drill 0.38)
  Top 0.203: IC1.41 42.46,13 v41.96,12.5
  Bottom 0.203: J3.24 58.37,2.69 48.18,2.69 47.78,3.1 45.77,3.1 45.41,3.45 42.11,3.45 40.69,4.88 40.69,8.43 40.18,8.94 40.18,11.23 41.45,12.5 v41.96,12.5
RF5  (via drill 0.38)
  Top 0.203: IC1.42 41.95,13.5 41.2,12.75 41.2,11.73 v41.45,11.48
  Bottom 0.203: J3.25 60.91,2.69 59.13,2.69 58.75,3.07 58.75,3.1 48.41,3.1 47.98,3.53 46,3.53 45.67,3.86 42.47,3.86 41.2,5.13 41.2,8.69 40.69,9.19 40.69,10.72 v41.45,11.48
RG6  (via drill 0.38)
  Top 0.203: 8.66,16.59 7.27,15.2 J1.5 3.77,15.2 v2.59,14.02 | 8.66,16.59 10.16,18.08 v10.16,19.76 | v25.65,18.54 25.65,18.64 26.57,17.73 27.63,17.73 30.36,15 IC1.4 | J5.5 10.74,14.5 8.66,16.59
  Bottom 0.203: v10.16,19.76 11.58,21.18 24.43,21.18 25.5,20.12 25.5,18.69 v25.65,18.54 | v2.59,14.02 2.59,2.59 J3.2
RG7  (via drill 0.38)
  Top 0.203: v29.08,15.29 29.87,14.5 IC1.5 | J5.7 19.24,16.7 v19.35,16.81 | J1.7 v3.48,17.4
  Bottom 0.203: 5.18,15.7 19.35,15.7 | 19.35,15.7 22.25,15.7 22.91,15.04 28.83,15.04 v29.08,15.29 | J3.3 5.13,2.59 5.13,15.65 5.18,15.7 | v3.48,17.4 5.18,15.7 | v19.35,16.81 19.35,15.7
RG8  (via drill 0.38)
  Top 0.203: J3.4 v8.94,13 v8.93,13 J1.3 | IC1.6 29.36,14 v29.08,14.27 | J5.3 19.16,12.3 v19.61,12.75
  Bottom 0.203: 19.61,15.29 11.23,15.29 v8.94,13 | 19.61,15.29 21.89,15.29 22.91,14.27 v29.08,14.27 | v19.61,12.75 19.61,15.29
RG9  (via drill 0.38)
  Top 0.203: J3.5 v11.48,6.4 | J1.2 v7.26,11.9 v7.26,11.89 | v29.79,10.64 31.15,12 IC1.10 | R1.2 v24.87,10.39 | J5.2 16.79,11.2 16.56,10.97 16.56,10.72 v15.54,9.7
  Bottom 0.203: 10.85,8.31 11.48,7.67 v11.48,6.4 12.75,5.13 23.93,5.13 24.87,6.07 v24.87,10.39 25.12,10.64 v29.79,10.64 | 10.85,8.31 v7.26,11.89 | v15.54,9.7 12.24,9.7 10.85,8.31
USBID/RF3  (via drill 0.38)
  Top 0.203: v50.11,12.22 49.4,11.5 47.29,11.5 | J4.4 64.65,13.43 v64.06,14.02 | v40.69,15.8 40.69,15.04 39.67,14.02 39.67,11.23 40.69,10.21 42.21,10.21 42.85,10.85 42.85,11.23 43.12,11.5 IC1.38 47.29,11.5 | R9.1 47.29,11.5
  Bottom 0.203: v50.11,12.22 62.26,12.22 v64.06,14.02 | J2.17 30.53,22.91 37.9,22.91 40.69,20.12 v40.69,15.8
VBUS  (via drill 0.38)  (1 unrouted)
  Top 0.203: IC1.33 45.02,9 v45.24,8.79
  Top 0.406: v63.04,9.58 64.94,11.48 J4.1 | D1.2 60.5,9.57 | 60.5,9.57 63.06,9.57 | JP1.1 60.4,9.67 60.5,9.57
  Bottom 0.203: v45.24,8.79 45.49,9.04 62.51,9.04 v63.04,9.58
VIN  (via drill 0.38)
  Top 0.406: D2.2 v56.95,6.4
  Bottom 0.406: v56.95,6.4 64.82,6.4 J3.28

### Text on the board
tPlace: GND | 23 | 22 | 21 | 20 | 19 | 18 | 15 | 14 | 13 | 12 | 11 | 10 | 9 | 8 | 7 | 6 | 5 | 4 | 3 | 2 | 1 | 0 | 3.3V | GND | 17 | 16 | TX | RX | Vout | 21 | PRG | JP1 | RESET | PWR | FubarinoSDZ | 3.3V | GND | A12 | A10 | RST | 3.3 | GND | v1.0 | GND | Vin | SCK | SDI | SDO | SS | 35 | A8 | 36 | A7 | 37 | A6 | 38 | A5 | 39 | A4 | 40 | A3 | 41 | A2 | 42 | A1 | 43 | A0 | 44 | RX | TX | A11 | A9 | 28 | 29 | 24 | 25 | 26 | 27 | A14 | A13
bPlace: Fubarino SDZ | www.fubarino.org/SD | www.schmalzhaus.com | designed by:
tDocu: ASSEMBLY NOTES: UNLESS OTHERWISE SPECIFIED / 1. ALL COMONENTS ARE RoHS COMPLIANT. / 2. ALL THROUGH HOLE COMPONENTS MOUNTED ON THE TOP SIDE / 3. ALL COMPONENTS AHLL BE MOUNTED FLUSH TO THE BOARD / 4. ALL UNUSED COMPONENTS PADS SHALL BE FREE OF SOLDER / 5. ALL LEADS SHALL BE TRIMMED TO A MAXIMUM LENGTH OF : N/A / 6. MAXIMUM COMPONENT HEIGHT NOT TO EXEED: N/A / 7. THESE COMPONENTS REQUIRE SOCKETS: NONE. / 8. UNPOPULATED COMPONENTS: SEE BILL OF MATERIALS / 9. FINISHED BOARD SHALL BE FREE FO ALL RESIDUES | TITLE: FUBARINO SD / VERSION: 1.5 / DATE: 2/27/2013 / PCB DESIGNER: BRIAN SCHMALZ / ENGINEER: BRIAN SCHMALZ
tMap: Copyright 2012 Brian Schmalz Copyright and related rights are licensed under the Solderpad Hardware License, Version 0.51 (the “License”); | you may not use this file except in compliance with the License. You may obtain a copy of the License at http://solderpad.org/licenses/SHL-0.51. Unless required by applicable law or agreed to in writing, | software, hardware and materials distributed under this License is distributed on an “AS IS” BASIS, WITHOUT WARRANTIES OR CONDITIONS OF ANY KIND, either express or implied. | See the License for the specific language governing permissions and limitations under the License.
DrillLegend: LAYER-STACK
DrillLegend_01-16: 01-16
DrillLegend_01-20: 01-20
Contour: Notes: / This PCB to be manufactued to meet all acceptance levels / of a CLASS 2 PCB per ANSI/IPC-A-600G. / Material: Isola PCL370HR FR-4 or equivalent. / Multilayer / 2 Layers / Controlled Impedance / Cu weight external layers : 1oz / Cu weight internal layers : / Finished overall thickenss : 0.062 / Finish: / Immersion Gold / X Immersion Tin / Soldermask over bare copper (SMOBC) with / Hot-Air-Leveled-Solder / If edge connector fingers are present, plate / with Nicel/Gold >= 20 microinches Gold / / Soldermask: Dynachem EPIC 200 LPI or equivalent. / Soldermask Color: Green / Silkscreen Color: White / / Artwork Set No. 05-10133 Rev 1.5 / / All holes to be located by the NC Drill File. / Indicate Country where PCB was fabricated on the / side indicated. / Any devication from the above specs must be approved / by Schmalz Haus LLC.